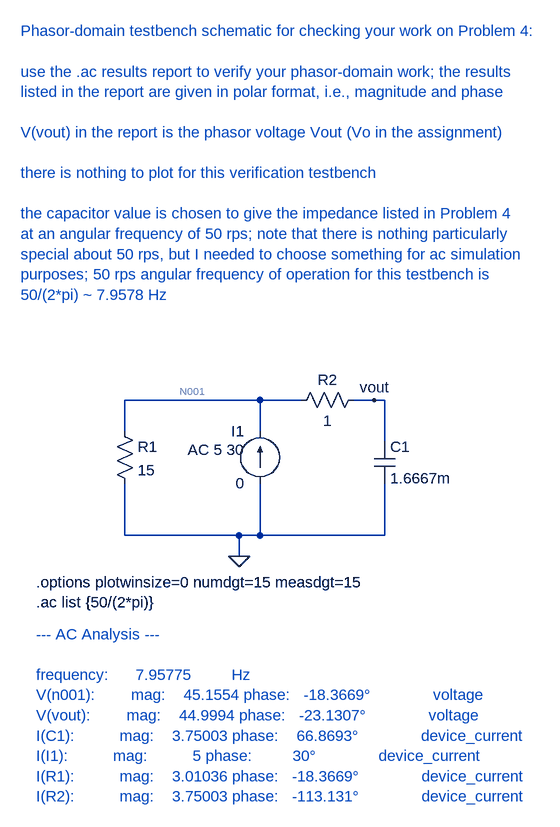
[diagram p0: schematic hw7_prob4.asc]
hw7_prob4.asc, the LTspice schematic file:
Version 4
SHEET 1 1040 692
WIRE -176 -80 -384 -80
WIRE -112 -80 -176 -80
WIRE 0 -80 -32 -80
WIRE 16 -80 0 -80
WIRE -384 -32 -384 -80
WIRE -176 -32 -176 -80
WIRE 16 -16 16 -80
WIRE -384 128 -384 48
WIRE -208 128 -384 128
WIRE -176 128 -176 48
WIRE -176 128 -208 128
WIRE 16 128 16 48
WIRE 16 128 -176 128
WIRE -208 160 -208 128
FLAG -208 160 0
FLAG 0 -80 vout
SYMBOL res -400 -48 R0
SYMATTR InstName R1
SYMATTR Value 15
SYMBOL current -176 48 R180
WINDOW 0 24 80 Left 2
WINDOW 3 24 0 Left 2
WINDOW 123 24 52 Left 2
SYMATTR InstName I1
SYMATTR Value 0
SYMATTR Value2 AC 5 30
SYMBOL cap 0 -16 R0
SYMATTR InstName C1
SYMATTR Value 1.6667m
SYMBOL res -16 -96 R90
WINDOW 0 0 56 VBottom 2
WINDOW 3 32 56 VTop 2
SYMATTR InstName R2
SYMATTR Value 1
TEXT -520 200 Left 2 !.options plotwinsize=0 numdgt=15 measdgt=15\n.ac list {50/(2*pi)}
TEXT -544 -648 Left 2 ;Phasor-domain testbench schematic for checking your work on Problem 4:\n \nuse the .ac results report to verify your phasor-domain work; the results\nlisted in the report are given in polar format, i.e., magnitude and phase\n \nV(vout) in the report is the phasor voltage Vout (Vo in the assignment)\n \nthere is nothing to plot for this verification testbench\n \nthe capacitor value is chosen to give the impedance listed in Problem 4\nat an angular frequency of 50 rps; note that there is nothing particularly\nspecial about 50 rps, but I needed to choose something for ac simulation\npurposes; 50 rps angular frequency of operation for this testbench is \n50/(2*pi) ~ 7.9578 Hz
TEXT -520 280 Left 2 ;--- AC Analysis ---\n \nfrequency:      7.95775         Hz\nV(n001):        mag:    45.1554 phase:   -18.3669°              voltage\nV(vout):        mag:    44.9994 phase:   -23.1307°              voltage\nI(C1):          mag:    3.75003 phase:    66.8693°              device_current\nI(I1):          mag:          5 phase:         30°              device_current\nI(R1):          mag:    3.01036 phase:   -18.3669°              device_current\nI(R2):          mag:    3.75003 phase:   -113.131°              device_current

The netlist it stands for:
* hw7_prob4.asc
R1 N001 0 15
I1 0 N001 0 AC 5 30
C1 vout 0 1.6667m
R2 vout N001 1
.options plotwinsize=0 numdgt=15 measdgt=15
.ac list {50/(2*pi)}
* Phasor-domain testbench schematic for checking your work on Problem 4:
* use the .ac results report to verify your phasor-domain work; the results
* listed in the report are given in polar format, i.e., magnitude and phase
* V(vout) in the report is the phasor voltage Vout (Vo in the assignment)
* there is nothing to plot for this verification testbench
* the capacitor value is chosen to give the impedance listed in Problem 4
* at an angular frequency of 50 rps; note that there is nothing particularly
* special about 50 rps, but I needed to choose something for ac simulation
* purposes; 50 rps angular frequency of operation for this testbench is
* 50/(2*pi) ~ 7.9578 Hz
* --- AC Analysis ---
* frequency:      7.95775         Hz
* V(n001):        mag:    45.1554 phase:   -18.3669°              voltage
* V(vout):        mag:    44.9994 phase:   -23.1307°              voltage
* I(C1):          mag:    3.75003 phase:    66.8693°              device_current
* I(I1):          mag:          5 phase:         30°              device_current
* I(R1):          mag:    3.01036 phase:   -18.3669°              device_current
* I(R2):          mag:    3.75003 phase:   -113.131°              device_current
.backanno
.end

* Results of the author's LTspice run, read from the files saved beside the schematic
* AC Analysis:
*   frequency = 7.958 
*   V(n001) = 42.86 V
*   V(vout) = 41.38 V
*   I(C1) = 1.473 A
*   I(I1) = 4.33 A
*   I(R1) = 2.857 A
*   I(R2) = -1.473 A